# EAGLE board Principal (EAGLE 9.2.2)
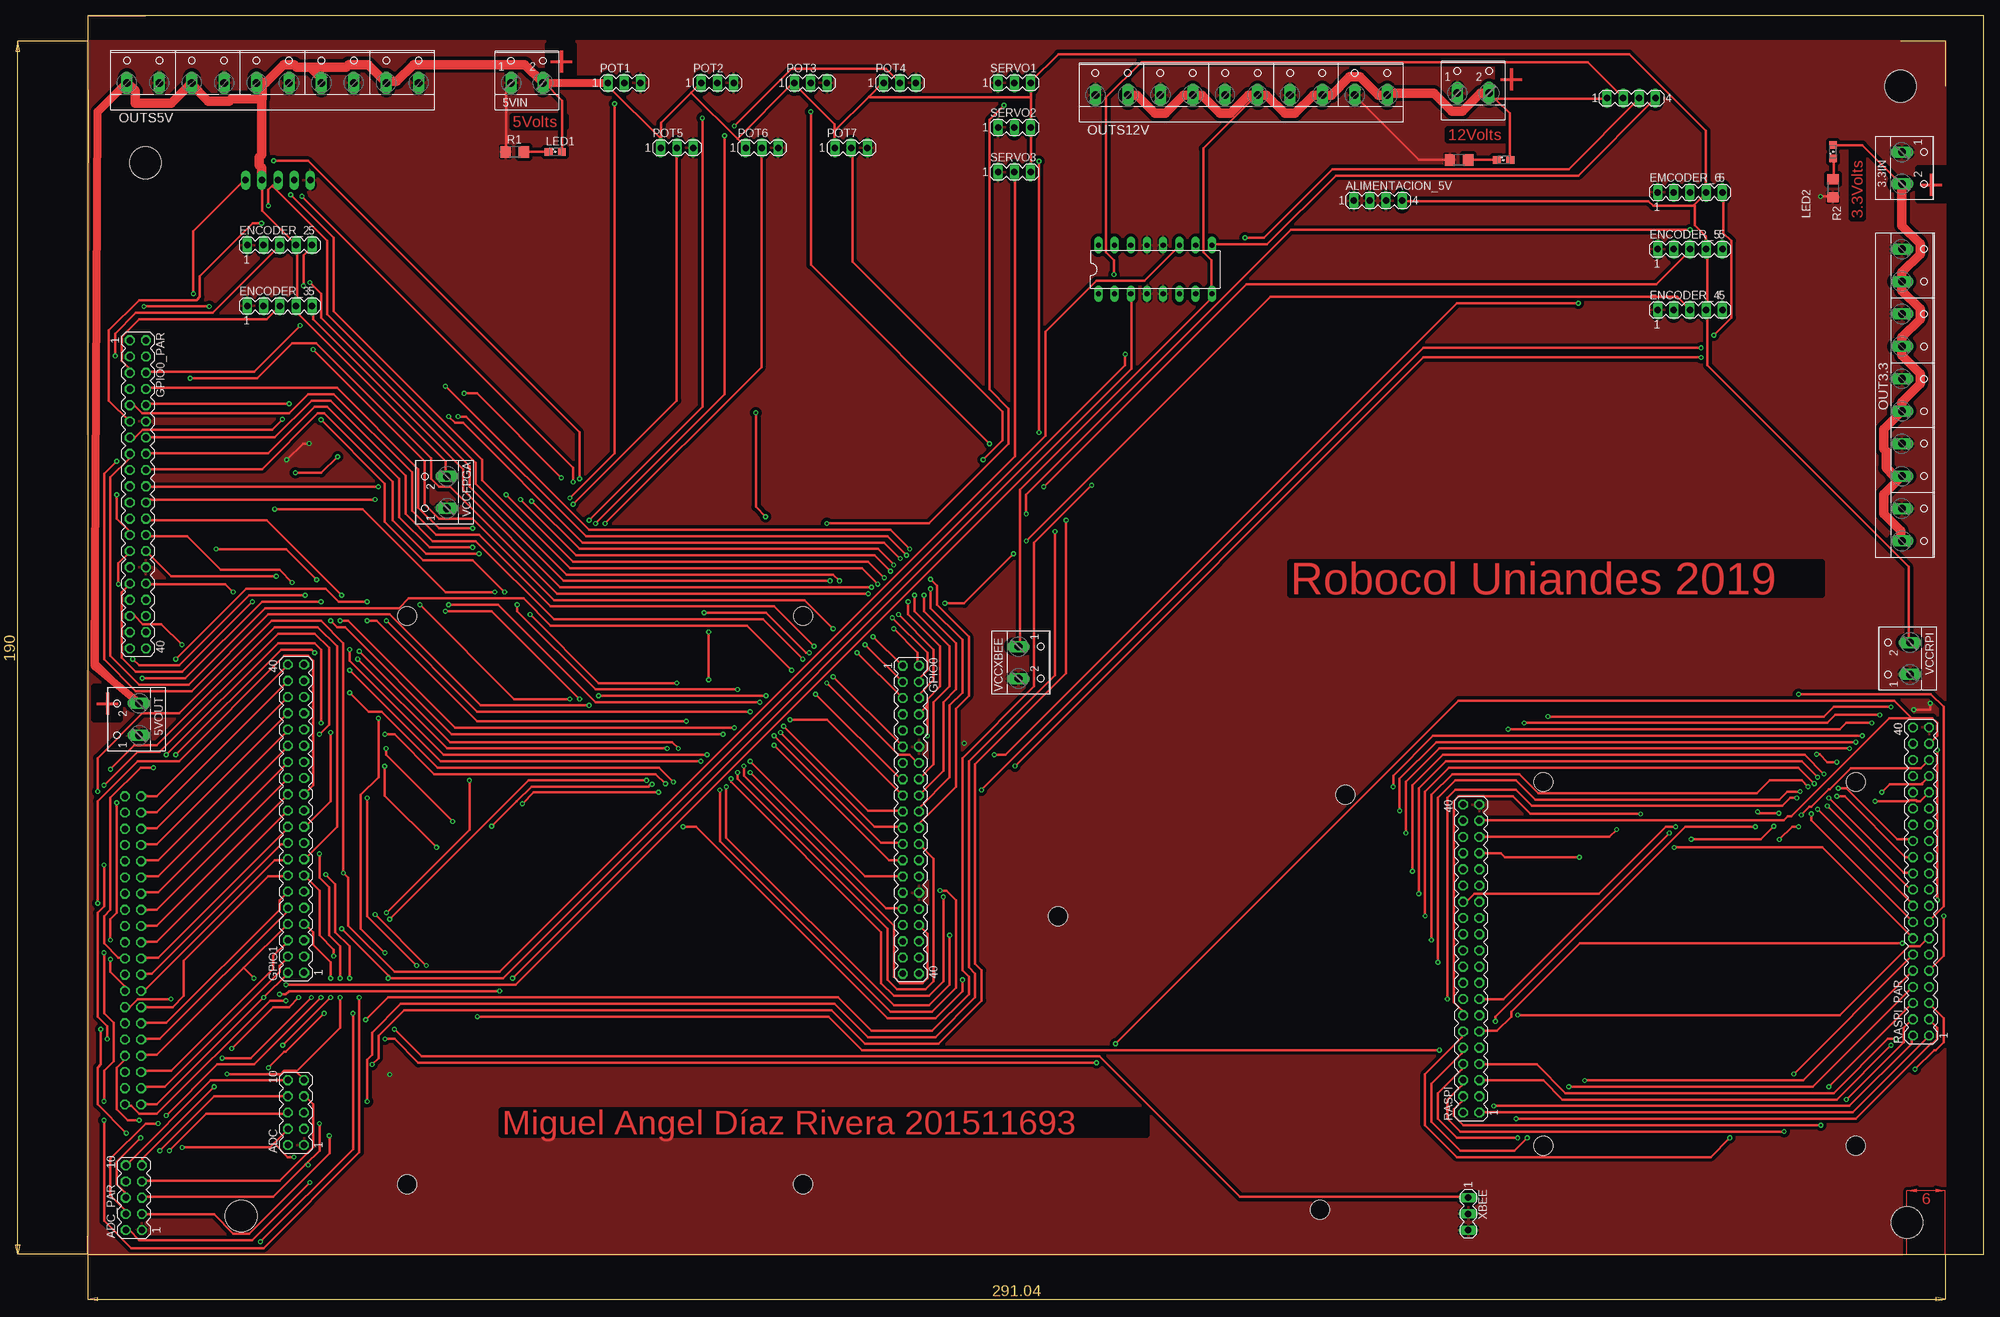
[diagram p2: board, top side]
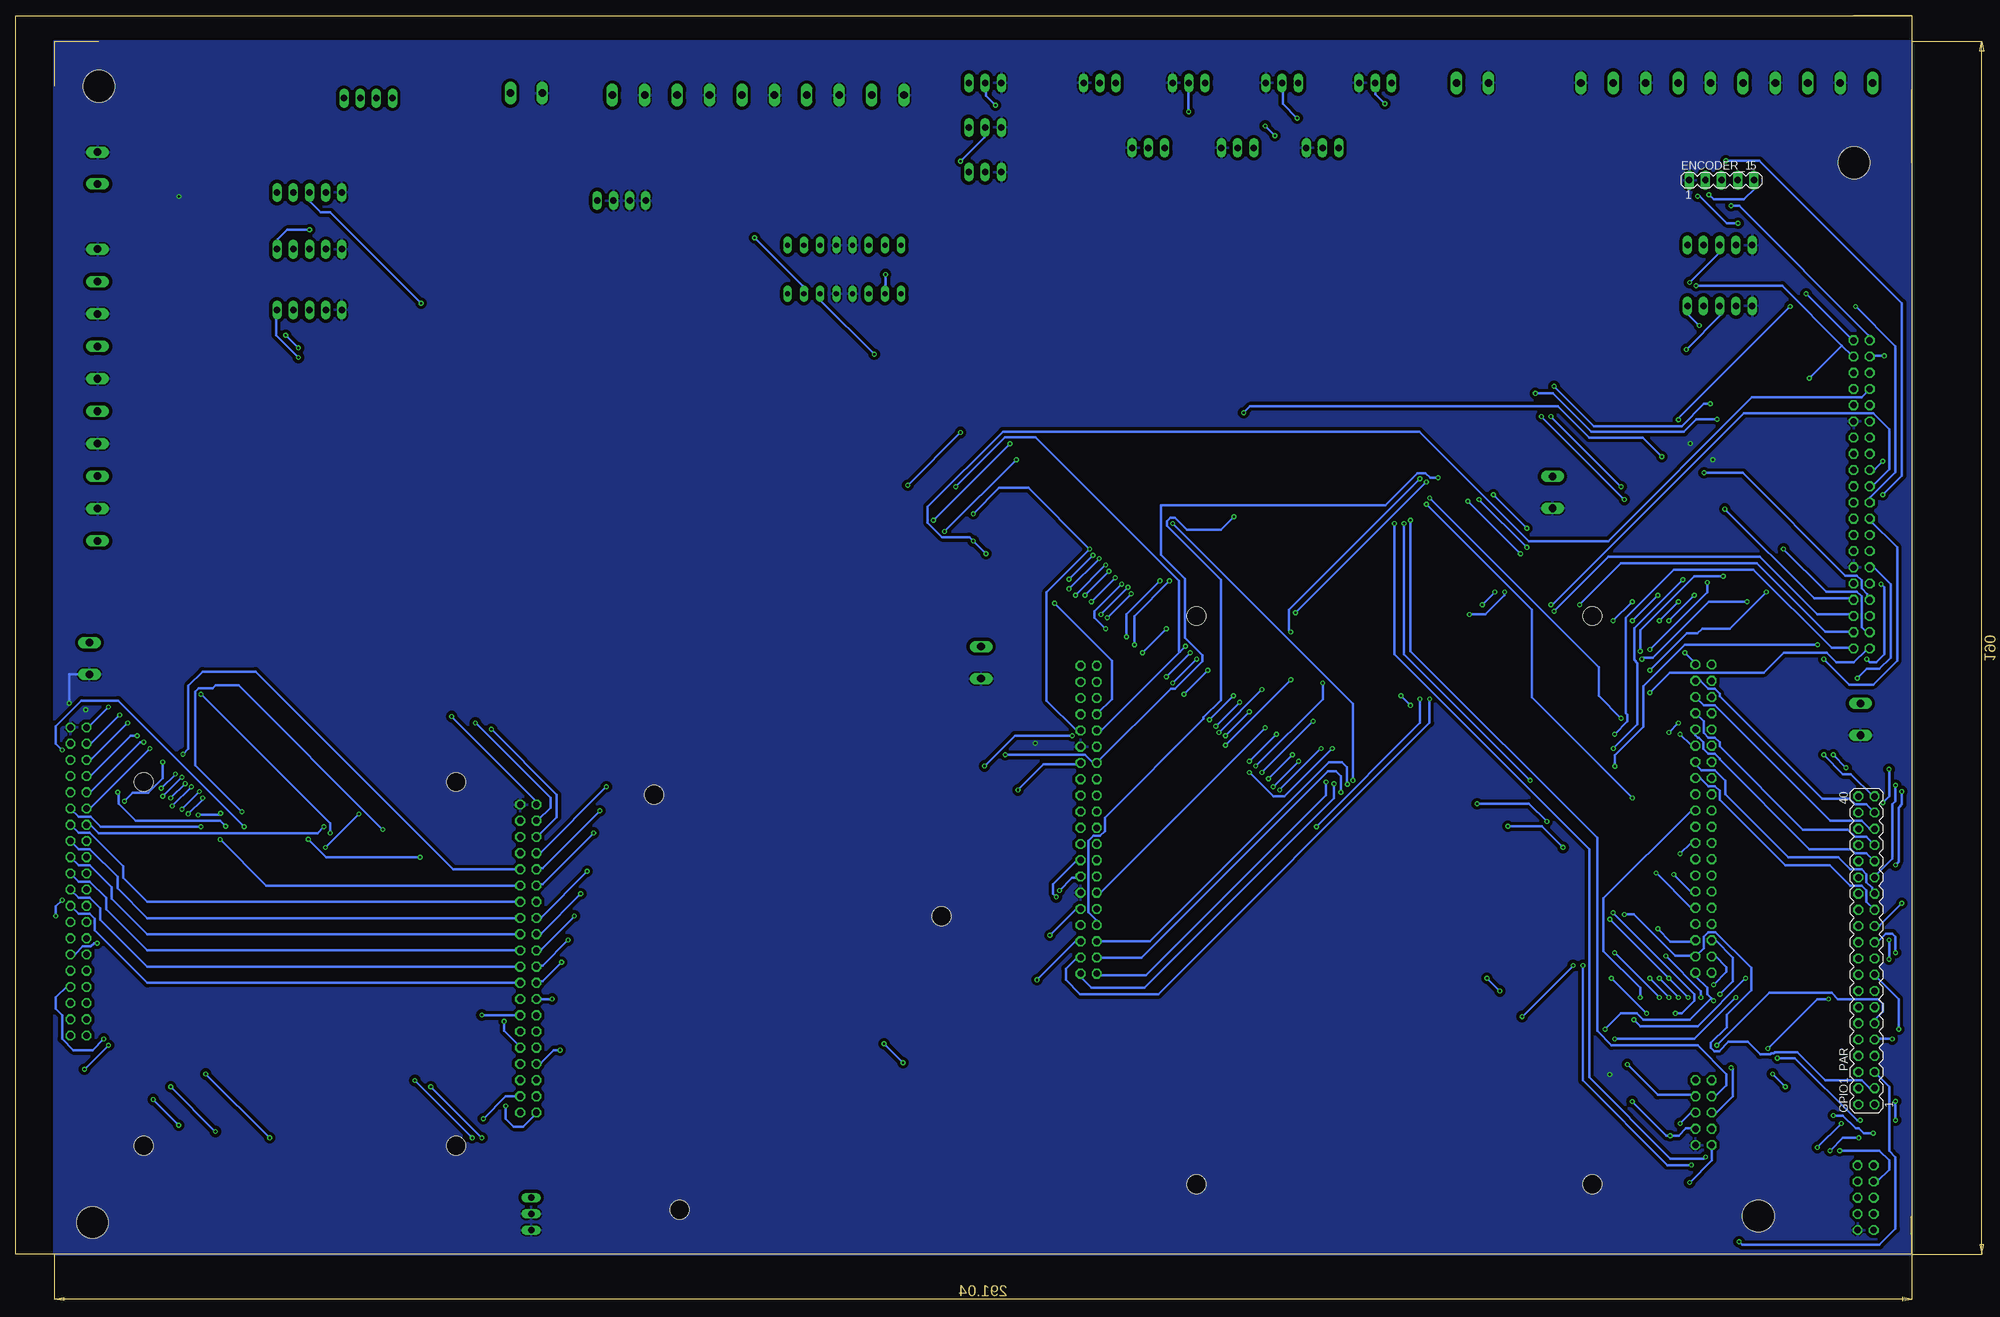
[diagram p3: board, bottom side, seen from below]

Size 297.02 x 194 mm. Coordinates in mm from the lower left corner, seen from the top.
Outline: 0,0 297.02,0 297.02,194 0,194 0,0
Copper layers (1*16): Top 0.035mm / dielectric 1.5mm / Bottom 0.035mm
Design rules "default *": minimum track width 0.4mm, minimum drill 0.35mm, track to track 0.5mm, track to pad 0.5mm, pad to pad 0.5mm, via to via 0.5mm, smd to smd 0.5mm, copper to edge 0mil, drill to drill 6mil, minimum pad ring 10mil, minimum via ring 8mil, stop-mask expansion 4mil, vias tented up to drill 0mil, thermal gap 10mil
Holes 3 mm at 228.02,17 277.02,17 228.02,74 277.02,74 50.02,11 112.02,11 50.02,100 112.02,100 193.02,7 197.02,72 152.02,53
Holes 5 mm at 9.02,171 24.02,6 285.02,5 284.02,183

## Footprints (pad centres in the part's own frame; a part is rotated, then mirrored left to right if it is on the bottom)
W237-102 = drill 1.194 long: 1 -2.5,-1.27; 2 2.5,-1.27
MA05-2 = drill 1.016 octagon: 1 -5.08,-1.27; 2 -5.08,1.27; 3 -2.54,-1.27; 4 -2.54,1.27; 5 0,-1.27; 6 0,1.27; 7 2.54,-1.27; 8 2.54,1.27; 9 5.08,-1.27; 10 5.08,1.27
MA04-1 = drill 1.016 long: 1 -3.81,0; 2 -1.27,0; 3 1.27,0; 4 3.81,0
DIL16 = drill 0.813 long: 1 -8.89,-3.81; 2 -6.35,-3.81; 3 -3.81,-3.81; 4 -1.27,-3.81; 5 1.27,-3.81; 6 3.81,-3.81; 7 6.35,-3.81; 8 8.89,-3.81; 9 8.89,3.81; 10 6.35,3.81; 11 3.81,3.81; 12 1.27,3.81; 13 -1.27,3.81; 14 -3.81,3.81; 15 -6.35,3.81; 16 -8.89,3.81
MA05-1 = drill 1.016 long: 1 -5.08,0; 2 -2.54,0; 3 0,0; 4 2.54,0; 5 5.08,0
MA20-2 = drill 1.016 octagon: 1 -24.13,-1.27; 2 -24.13,1.27; 3 -21.59,-1.27; 4 -21.59,1.27; 5 -19.05,-1.27; 6 -19.05,1.27; 7 -16.51,-1.27; 8 -16.51,1.27; 9 -13.97,-1.27; 10 -13.97,1.27; 11 -11.43,-1.27; 12 -11.43,1.27; 13 -8.89,-1.27; 14 -8.89,1.27; 15 -6.35,-1.27; 16 -6.35,1.27; 17 -3.81,-1.27; 18 -3.81,1.27; 19 -1.27,-1.27; 20 -1.27,1.27; 21 1.27,-1.27; 22 1.27,1.27; 23 3.81,-1.27; 24 3.81,1.27; 25 6.35,-1.27; 26 6.35,1.27; 27 8.89,-1.27; 28 8.89,1.27; 29 11.43,-1.27; 30 11.43,1.27; 31 13.97,-1.27; 32 13.97,1.27; 33 16.51,-1.27; 34 16.51,1.27; 35 19.05,-1.27; 36 19.05,1.27; 37 21.59,-1.27; 38 21.59,1.27; 39 24.13,-1.27; 40 24.13,1.27
SML0805 = smd 1.2 x 1.2: A 1.05,0; C -1.05,0
W237-10P = drill 1.194 long: 1 -22.86,-0.635; 2 -17.78,-0.635; 3 -12.7,-0.635; 4 -7.62,-0.635; 5 -2.54,-0.635; 6 2.54,-0.635; 7 7.62,-0.635; 8 12.7,-0.635; 9 17.78,-0.635; 10 22.86,-0.635
MA03-1 = drill 1.016 long: 1 -2.54,0; 2 0,0; 3 2.54,0
R1206 = smd 1.6 x 1.803: 1 -1.422,0; 2 1.422,0

## Placement (x,y rotation side)
3.3IN  [W237-102]  285.5,170.18 270 top
5VIN  [W237-102]  68.78,184.78 0 top
5VOUT  [W237-102]  6.73,83.82 90 top
12VIN  [W237-102]  217.05,183.19 0 top
ADC  [MA05-2]  32.59,22.21 90 top
ADC_PAR  [MA05-2]  7.19,8.88 90 top
ALIMENTACION_5V  [MA04-1]  202.13,165.09 0 top
CONTROL_RGB  ULN2064BN  [DIL16]  167.21,154.29 0 top
EMCODER_6  [MA05-1]  251.03,166.36 0 top
ENCODER_1  [MA05-1]  29.77,168.26 0 bottom
ENCODER_2  [MA05-1]  30.05,158.1 0 top
ENCODER_3  [MA05-1]  30.05,148.58 0 top
ENCODER_4  [MA05-1]  251.03,147.94 0 top
ENCODER_5  [MA05-1]  251.03,157.47 0 top
GPIO0  [MA20-2]  128.94,68.09 270 top
GPIO0_PAR  [MA20-2]  7.82,119.06 270 top
GPIO1  [MA20-2]  32.59,68.26 90 top
GPIO1_PAR  [MA20-2]  7.06,47.62 90 bottom
LED1  [SML0805]  73.23,172.71 0 top
LED2  [SML0805]  273.43,172.72 90 top
LED3  [SML0805]  221.82,171.44 0 top
LUCESITAS  [MA04-1]  241.81,181.12 0 top
OUT3.3  [W237-10P]  284.86,134.62 270 top
OUTS5V  [W237-10P]  28.96,184.15 0 top
OUTS12V  [W237-10P]  180.72,182.25 0 top
POT1  [MA03-1]  84.02,183.5 0 top
POT2  [MA03-1]  98.63,183.5 0 top
POT3  [MA03-1]  113.23,183.5 0 top
POT4  [MA03-1]  127.2,183.5 0 top
POT5  [MA03-1]  92.28,173.34 0 top
POT6  [MA03-1]  105.61,173.34 0 top
POT7  [MA03-1]  119.58,173.34 0 top
R1  [R1206]  66.88,172.71 0 top
R2  [R1206]  273.43,167 90 top
R3  [R1206]  214.83,171.44 0 top
RASPI  [MA20-2]  216.74,46.34 90 top
RASPI_PAR  [MA20-2]  287.22,58.41 90 top
SERVO1  [MA03-1]  145.16,183.51 0 top
SERVO2  [MA03-1]  145.16,176.53 0 top
SERVO3  [MA03-1]  145.16,169.54 0 top
VCCFPGA  [W237-102]  54.99,119.38 90 top
VCCRPI  [W237-102]  284.23,93.34 90 top
VCCXBEE  [W237-102]  147.07,92.71 270 top
XBEE  [MA03-1]  216.28,6.35 270 top

## Tracks (layer width: path | path; a pad name or v marks a point on that pad's centre or on a via)
3.3VOLTIOS
  Top 0.4: LED2.A 273.52,173.75 278.02,173.75 284.02,167.75 3.3IN.2 | 281.89,119.62 284.02,121.75 OUT3.3.8 | 281.89,119.62 281.77,119.5 281.77,116.25 284.02,114 284.02,112.01 284.02,112 OUT3.3.10 | 281.77,119.75 281.89,119.62
  Top 1.524: 3.3IN.2 284.23,161.14 287.08,158.29 287.08,156.67 284.23,153.82 OUT3.3.2 284.23,150.98 287.08,148.13 287.08,146.51 284.23,143.66 OUT3.3.4 284.23,140.82 287.08,137.97 287.08,136.35 284.23,133.5 OUT3.3.6 281.37,129.23 281.37,126.19 281.77,125.8 281.77,123.19 283.04,121.92 OUT3.3.8 281.37,119.07 281.37,116.03 284.02,113.39 284.02,112.01
12VOLTIOS
  Top 0.4: 220.64,180.88 219.77,181.75 12VIN.2 | 220.64,180.88 222.77,178.75 222.77,171.5 LED3.A | LUCESITAS.1 237.77,181 220.77,181 220.64,180.88 | VCCXBEE.1 146.02,95.25 146.02,119.75 176.02,149.75 176.02,150.25 CONTROL_RGB.8 176.02,150.5 176.02,155.75 174.77,157 174.77,173.25 183.02,181.5 OUTS12V.6
  Top 1.524: 12VIN.2 218.21,181.92 215.36,179.07 213.73,179.07 210.88,181.92 203.89,181.92 OUTS12V.10 202.16,181.61 199.31,184.46 197.69,184.46 194.84,181.61 OUTS12V.8 192,181.61 189.15,178.76 187.53,178.76 184.68,181.61 OUTS12V.6 181.84,181.61 178.99,178.76 177.37,178.76 174.52,181.61 OUTS12V.4 171.68,181.61 168.83,178.76 167.21,178.76 164.36,181.61 OUTS12V.2
+5V3
  Top 0.4: 251.64,164.38 253.52,166.25 EMCODER_6.4 253.52,166.5 253.52,176 241.48,188.03 152.05,188.03 147.77,183.75 SERVO1.3 147.77,183.5 147.77,181.25 | 251.64,164.38 251.52,164.25 245.27,164.25 244.52,165 206.02,165 ALIMENTACION_5V.4 | VCCRPI.2 285.27,96 285.27,107.75 253.77,139.25 253.77,147.75 ENCODER_4.4 253.77,148 253.77,157.25 ENCODER_5.4 253.52,157.5 253.52,159.5 251.77,161.25 251.77,164.25 251.64,164.38 | 1.52,179 1.52,92.75 7.77,86.5 5VOUT.2 | 16.02,183.5 OUTS5V.3 16.27,183.5 | LED1.A 74.27,172.75 74.27,180.75 71.52,183.5 5VIN.2 71.77,183.5 81.27,183.5 POT1.1 81.52,183.5 81.52,183.29 81.52,183 89.77,174.75 | SERVO3.3 147.77,169.75 147.77,176.5 SERVO2.3 147.77,176.75 147.77,181.25 | 89.77,174.75 89.77,177.25 94.52,182 | 89.77,174.75 89.77,173.5 POT5.1 89.77,174.75 | 94.52,182 96.02,183.5 POT2.1 | 94.52,182 101.77,174.75 | 101.77,174.75 103.02,173.5 POT6.1 | 101.77,174.75 110.52,183.5 | 117.02,176 117.02,177 110.52,183.5 | 117.02,176 117.02,173.5 POT7.1 | 110.52,183.5 POT3.1 | 117.02,176 122.39,181.38 | 122.39,181.38 124.52,183.5 POT4.1 | 147.77,181.25 122.52,181.25 122.39,181.38 | 27.27,183.75 28.77,183.75 31.02,186 34.27,186 34.39,185.88 | 27.27,183.75 26.52,183.75 OUTS5V.5 27.27,183.75 | 34.39,185.88 36.52,183.75 OUTS5V.7 | 35.05,186 34.8,186 34.52,186 34.39,185.88 | VCCFPGA.2 56.02,122 56.02,124.25 32.77,147.5 32.77,148.5 ENCODER_3.4 32.77,148.75 32.77,158 ENCODER_2.4 32.52,158.25 27.27,163.5 27.27,168.25 ENCODER_1.4 27.27,168.5 27.27,181 | 27.27,181 27.27,183.75 | 46.77,183.75 OUTS5V.9 | 27.27,181 20.77,181
  Top 1.27: 5VIN.2 81.3,183.5 81.52,183.29 | 5VOUT.2 1.09,92.13 1.52,179 OUTS5V.1
  Top 1.524: 46.77,183.75 48.39,183.75 51,186.37 68.42,186.37 5VIN.2 | OUTS5V.9 43.88,186.37 40.84,186.37 40.48,186 35.05,186 32.67,186 32.31,186.37 30.69,186.37 27.83,183.51 OUTS5V.5 | OUTS5V.7 36.58,184.22 34.8,186 | OUTS5V.5 27.27,182.66 27.27,181 22.48,181 22.15,180.66 18.85,180.66 16.02,183.5 | OUTS5V.3 13.08,180.34 7.37,180.34 7.37,182.25 OUTS5V.1 | OUTS5V.5 27.23,182.7 27.23,172.28 26.8,171.86 26.8,170.64 27.23,170.22 ENCODER_1.4
GND  (via drill 0.35)
  Top 0.4: v271.49,165.72 273.29,165.72 R2.1 | R1.1 65.52,172.75 65.52,182.75 66.27,183.5 5VIN.1 | R3.1 213.27,171.5 208.52,171.5 198.52,181.5 OUTS12V.9 | v286.08,85.32 288.67,85.32 v288.67,86.33 | v31.14,124.46 33.71,127.03 v34.65,127.03
  Bottom 0.4: v288.67,86.33 288.67,90.84 VCCRPI.1
  other vias: 47.29,28.17 137.31,80.06
  pour Bottom: -0.03,0 -0.03,190 291.02,190 291.02,0
  pour Top: -0.03,190 291.02,190 291.02,0 -0.03,0
N$1
  Top 0.4: LED2.C 273.52,171.5 273.52,168.5 R2.2
N$4  (via drill 0.35)
  Top 0.4: v33.77,151.75 33.77,156.5 35.27,158 ENCODER_2.5 | v126.02,99.75 131.52,94.25 131.52,91.5 130.27,90.25 130.27,89.75 GPIO0.4 | v122.27,103.5 73.52,103.5 56.77,120.25 55.02,120.25 53.77,121.5 53.77,124.75 35.77,142.75 32.02,142.75 26.52,137.25 v16.02,137.25
  Bottom 0.4: 10.89,142.38 20.27,151.75 v33.77,151.75 | 10.89,142.38 9.27,140.75 GPIO0_PAR.4 | v122.27,103.5 v126.02,99.75 | 10.89,142.38 v16.02,137.25
N$8  (via drill 0.35)
  Top 0.4: v60.27,113.75 55.02,113.75 51.77,117 51.77,123 39.02,135.75 9.27,135.75 GPIO0_PAR.8 | v65.52,119 76.02,108.5 122.27,108.5 v124.77,106 | v128.52,102.25 128.52,100.25 133.52,95.25 133.52,89 131.52,87 131.52,86 131.39,85.88 | 131.39,85.88 130.27,84.75 GPIO0.8 | v252.77,140.5 209.27,140.5 v145.27,76.5 | v131.52,81.25 131.52,85.75 131.39,85.88
  Bottom 0.4: v65.52,119 v60.27,113.75 | v128.52,102.25 v124.77,106 | v252.77,140.5 256.27,144 256.27,147.75 ENCODER_4.5 | v145.27,76.5 140.52,81.25 v131.52,81.25
N$9  (via drill 0.35)
  Top 0.4: v113.77,95.25 107.52,101.5 72.52,101.5 61.27,112.75 54.52,112.75 50.77,116.5 50.77,122.5 38.52,134.75 34.52,134.75 31.52,131.75 8.52,131.75 7.27,133 6.77,133 GPIO0_PAR.9 | v149.77,120.25 181.52,152 245.77,152 251.02,157.25 ENCODER_5.3
  Bottom 0.4: 114.64,94.38 127.02,82 127.52,82 GPIO0.9 | 114.64,94.38 v113.77,95.25 | v149.77,120.25 142.02,128 137.27,128 114.77,105.5 114.77,94.5 114.64,94.38
N$11  (via drill 0.35)
  Top 0.4: v116.77,90.5 127.52,79.75 GPIO0.11 | v113.02,94.25 112.52,94.25 106.27,100.5 v96.52,100.5 | v76.02,121 76.02,123.25 v33.52,165.75 | v27.2,161.54 25.8,161.54 17.52,153.25 17.52,150 17.02,149.5 8.02,149.5 3.27,144.75 3.27,133.75 6.52,130.5 GPIO0_PAR.11
  Bottom 0.4: v113.02,94.25 v116.77,90.5 | v76.02,121 v96.52,100.5 | v33.52,165.75 33.13,165.75 28.92,161.54 v27.2,161.54
N$14  (via drill 0.35)
  Top 0.4: v112.02,93.25 105.77,99.5 73.02,99.5 60.77,111.75 54.02,111.75 49.77,116 49.77,122 38.02,133.75 35.02,133.75 29.27,128 9.27,128 GPIO0_PAR.14 | v115.77,89.5 127.02,78.25 128.77,78.25 130.02,77 GPIO0.14 | v254.77,144 257.52,146.75 257.52,158.75 256.27,160 256.27,166.25 EMCODER_6.5 | v252.77,142 209.27,142 v140.02,72.75
  Bottom 0.4: v115.77,89.5 v112.02,93.25 | v252.77,142 v254.77,144 | v140.02,72.75 136.02,76.75 130.27,76.75 GPIO0.14
N$15  (via drill 0.35)
  Top 0.4: v110.27,91.5 103.27,98.5 72.52,98.5 68.27,102.75 50.27,102.75 48.77,101.25 27.77,101.25 15.77,89.25 8.02,89.25 3.52,93.75 3.52,121.75 6.52,124.75 6.52,125.25 GPIO0_PAR.15 | v114.02,87.75 127.52,74.25 GPIO0.15
  Bottom 0.4: v114.02,87.75 v110.27,91.5
N$16  (via drill 0.35)
  Top 0.4: v60.27,110.75 53.52,110.75 48.77,115.5 48.77,121.5 37.52,132.75 35.52,132.75 28.27,125.5 9.27,125.5 GPIO0_PAR.16 | v67.77,118.25 76.52,109.5 123.27,109.5 v125.77,107 | v129.52,103.25 129.52,100.75 135.02,95.25 135.02,89 132.52,86.5 132.52,76.75 GPIO0.16
  Bottom 0.4: v67.77,118.25 v60.27,110.75 | v129.52,103.25 v125.77,107
N$17  (via drill 0.35)
  Top 0.4: v4.52,124.25 2.52,122.25 2.52,93.25 7.52,88.25 16.27,88.25 28.27,100.25 47.27,100.25 61.52,86 v78.52,86 | v106.27,87.5 v80.02,87.5 | v110.02,83.75 115.77,83.75 127.52,72 GPIO0.17
  Bottom 0.4: v4.52,124.25 5.77,123 6.52,123 GPIO0_PAR.17 | v80.02,87.5 v78.52,86 | v110.02,83.75 v106.27,87.5
N$18  (via drill 0.35)
  Top 0.4: v61.27,109.75 53.02,109.75 47.77,115 47.77,121 37.02,131.75 36.02,131.75 27.27,123 9.27,123 GPIO0_PAR.18 | v69.52,118 77.02,110.5 123.77,110.5 v126.27,108 | v131.02,103.25 131.02,100.75 136.02,95.75 136.02,88.5 134.02,86.5 134.02,75.75 130.27,72 GPIO0.18
  Bottom 0.4: v69.52,118 v61.27,109.75 | v131.02,103.25 v126.27,108
N$19  (via drill 0.35)
  Top 0.4: v109.02,82.75 122.27,69.5 127.52,69.5 GPIO0.19 | v105.27,86.5 79.52,86.5 64.27,101.75 v56.52,101.75
  Bottom 0.4: v105.27,86.5 v109.02,82.75 | v56.52,101.75 56.26,101.75 26.26,131.75 6.02,131.75 3.52,129.25 3.52,123 6.02,120.5 6.52,120.5 GPIO0_PAR.19
N$20  (via drill 0.35)
  Top 0.4: v132.02,104.25 132.02,101.25 137.02,96.25 137.02,88 135.02,86 135.02,74.75 130.27,70 130.27,69.5 GPIO0.20 | v127.27,109 124.77,111.5 77.52,111.5 58.77,130.25 57.52,130.25 v56.52,131.25 | v45.52,120.25 9.27,120.25 GPIO0_PAR.20
  Bottom 0.4: v127.27,109 v132.02,104.25 | v45.52,120.25 v56.52,131.25
N$21  (via drill 0.35)
  Top 0.4: v108.52,81.75 123.27,67 127.52,67 GPIO0.21 | v101.77,88.5 79.52,88.5 67.27,100.75 v67.27,101.75 | v65.27,103.75 60.27,108.75 52.52,108.75 46.52,114.75 46.52,120.75 v36.52,130.75 | v19.02,148.5 v8.77,148.5
  Bottom 0.4: v101.77,88.5 v108.52,81.75 | v65.27,103.75 v67.27,101.75 | v36.52,130.75 36.52,131 v19.02,148.5 | v8.77,148.5 2.52,142.25 2.52,122.5 6.52,118.5 6.52,118 GPIO0_PAR.21
N$22  (via drill 0.35)
  Top 0.4: v132.02,105.75 133.02,104.75 133.02,101.75 138.02,96.75 138.02,87.5 136.02,85.5 136.02,73.25 130.27,67.5 130.27,67 GPIO0.22 | v128.27,109.5 125.27,112.5 78.02,112.5 59.27,131.25 v58.02,131.25 | v45.02,118.25 9.52,118.25 9.27,118 GPIO0_PAR.22
  Bottom 0.4: v128.27,109.5 v132.02,105.75 | v45.02,118.25 v58.02,131.25
N$23  (via drill 0.35)
  Top 0.4: v13.77,93.25 24.77,104.25 37.27,104.25 39.27,102.25 v43.77,102.25 | v46.77,99.25 61.02,85 v103.77,85 | v107.52,81.25 124.27,64.5 127.52,64.5 GPIO0.23
  Bottom 0.4: v13.77,93.25 9.77,89.25 6.02,89.25 2.27,93 2.27,110.75 6.52,115 GPIO0_PAR.23 | v46.77,99.25 v43.77,102.25 | v107.52,81.25 v103.77,85
N$24  (via drill 0.35)
  Top 0.4: v39.77,103.25 28.02,115 9.27,115 GPIO0_PAR.24 | v43.77,99.25 45.27,99.25 61.02,83.5 v93.77,83.5 | v101.77,75.5 101.77,74.5 125.27,51 125.27,43 126.77,41.5 131.27,41.5 132.52,42.75 132.52,62 130.27,64.25 GPIO0.24
  Bottom 0.4: v43.77,99.25 v39.77,103.25 | v101.77,75.5 v93.77,83.5
N$25  (via drill 0.35)
  Top 0.4: v4.52,119 4.52,115.25 6.52,113.25 6.52,112.75 GPIO0_PAR.25 | v29.08,171.3 34.46,171.3 77.02,128.75 v77.02,121.5 | v97.27,90 v97.27,97.5 | v107.52,79.75 125.52,61.75 127.52,61.75 GPIO0.25
  Bottom 0.4: v4.52,119 1.52,122 1.52,149 23.82,171.3 v29.08,171.3 | v77.02,121.5 97.52,101 97.52,97.75 v97.27,97.5 | v107.52,79.75 v97.27,90
N$26  (via drill 0.35)
  Top 0.4: v32.02,105.25 30.02,107.25 20.77,107.25 15.52,112.5 9.27,112.5 GPIO0_PAR.26 | v41.02,94.75 41.02,93 55.77,78.25 v97.02,78.25 | v100.77,74.5 100.77,74 124.27,50.5 124.27,42.5 126.27,40.5 131.77,40.5 134.02,42.75 v134.02,56
  Bottom 0.4: v32.02,105.25 32.02,103.75 v41.02,94.75 | v100.77,74.5 v97.02,78.25 | v134.02,56 134.52,56.5 134.52,58 130.77,61.75 130.27,61.75 GPIO0.26
N$27  (via drill 0.35)
  Top 0.4: v103.77,77.25 121.77,59.25 127.52,59.25 GPIO0.27 | v99.52,81.5 57.02,81.5 40.27,98.25 39.02,98.25 v38.02,99.25 | v34.02,103.25 25.27,103.25 14.27,92.25 8.02,92.25 v7.02,93.25 | v4.77,105 4.77,108.25 6.52,110 GPIO0_PAR.27
  Bottom 0.4: v99.52,81.5 v103.77,77.25 | v34.02,103.25 v38.02,99.25 | v7.02,93.25 6.52,92.75 5.52,92.75 4.27,94 4.27,104.5 v4.77,105
N$28  (via drill 0.35)
  Top 0.4: v133.52,57 134.52,57 136.02,55.5 136.02,41.75 132.27,38 125.77,38 99.02,64.75 v99.02,72.75 | v92.52,79.25 91.52,80.25 56.77,80.25 v42.52,94.5 | v29.52,106.25 13.02,106.25 9.27,110 GPIO0_PAR.28
  Bottom 0.4: v133.52,57 131.52,59 130.27,59 GPIO0.28 | v92.52,79.25 v99.02,72.75 | v42.52,94.5 42.52,97.75 34.02,106.25 v29.52,106.25
N$29  (via drill 0.35)
  Top 0.4: v101.27,82.5 57.52,82.5 40.77,99.25 v39.52,99.25 | v36.52,102.25 27.27,102.25 15.27,90.25 v8.52,90.25
  Bottom 0.4: v101.27,82.5 127.02,56.75 127.52,56.75 GPIO0.29 | v36.52,102.25 v39.52,99.25 | v8.52,90.25 7.02,91.75 5.02,91.75 3.27,93.5 3.27,105 6.02,107.75 6.52,107.75 GPIO0_PAR.29
N$31  (via drill 0.35)
  Top 0.4: v103.77,75.5 125.02,54.25 127.52,54.25 GPIO0.31 | v90.77,79.25 56.27,79.25 v42.27,93.25 | v25.77,102.25 14.77,91.25 7.52,91.25 5.27,93.5 5.27,103.75 6.52,105 GPIO0_PAR.31
  Bottom 0.4: v103.77,75.5 100.02,71.75 98.27,71.75 v90.77,79.25 | v42.27,93.25 42.02,93.5 40.52,93.5 31.77,102.25 v25.77,102.25
N$32  (via drill 0.35)
  Top 0.4: v22.77,103.75 21.52,105 9.27,105 GPIO0_PAR.32 | v41.02,91.5 55.27,77.25 v96.02,77.25 | v100.02,73.25 100.02,65.25 126.27,39 131.77,39 135.02,42.25 v135.02,50
  Bottom 0.4: v22.77,103.75 28.47,98.04 32.77,98.04 33.53,97.28 35.23,97.28 v41.02,91.5 | v100.02,73.25 v96.02,77.25 | v135.02,50 130.77,54.25 130.27,54.25 GPIO0.32
N$33  (via drill 0.35)
  Top 0.4: v32.51,122.43 36.58,122.43 v39.12,124.97 | v104.65,131.83 104.65,117.09 v106.17,115.57
  Bottom 0.4: v32.51,122.43 26.43,122.43 10.35,106.35 8.56,106.35 7.82,105.61 7.82,104.34 6.92,103.44 6.92,102.92 GPIO0_PAR.33 | v39.12,124.97 42.1,127.95 50.51,127.95 55.4,132.84 103.63,132.84 v104.65,131.83 | v106.17,115.57 108.2,113.54 113.53,113.54 115.39,115.4 116.14,115.4 116.67,114.87 116.67,114.13 108.2,105.67 108.2,86.83 110.92,84.12 110.92,83.9 126.41,68.41 126.41,66.3 127.16,65.55 128.19,65.55 128.93,64.81 128.93,53.6 127.67,52.34 GPIO0.33
N$34  (via drill 0.35)
  Top 0.4: v29.27,116.75 43.02,116.75 56.02,103.75 v63.77,103.75 | v69.27,100.25 80.02,89.5 v92.27,89.5 | v102.77,76.5 102.77,75 126.27,51.5 126.27,43.5 127.27,42.5 130.77,42.5 131.52,43.25 131.52,50.25 130.27,51.5 GPIO0.34
  Bottom 0.4: v29.27,116.75 15.27,102.75 9.27,102.75 GPIO0_PAR.34 | v63.77,103.75 63.77,103.25 66.77,100.25 v69.27,100.25 | v92.27,89.5 92.27,87 v102.77,76.5
N$35  (via drill 0.35)
  Top 0.4: v88.41,73.65 88.19,73.65 87.83,73.29 69.48,73.29 67.17,70.98 v63.25,67.06 | v54.61,63.75 46.48,71.88 v46.48,76.45 | GPIO0_PAR.35 7.3,100 8.56,98.74 11.49,98.74 v14.73,95.5
  Bottom 0.4: GPIO0.35 119.36,49.05 91.31,77.1 89.29,77.1 88.51,76.32 88.51,73.75 v88.41,73.65 | v63.25,67.06 57.91,67.06 v54.61,63.75 | v14.73,95.5 35.56,95.5 42.03,89.04 42.03,82.69 46.48,78.23 v46.48,76.45
N$36  (via drill 0.35)
  Top 0.4: v56.02,100.75 63.27,100.75 v77.02,87 | v93.27,67 95.27,67 125.27,37 132.77,37 137.02,41.25 v137.02,43
  Bottom 0.4: v56.02,100.75 47.52,109.25 23.77,109.25 14.77,100.25 9.27,100.25 GPIO0_PAR.36 | v77.02,87 77.02,83.25 v93.27,67 | v137.02,43 130.77,49.25 130.27,49.25 GPIO0.36
N$37  (via drill 0.35)  (1 unrouted)
  Top 0.4: v89.41,72.39 69.85,72.39 v68.07,70.61 | v57.15,67.82 46.74,78.23 v46.74,79.25 | v35.83,105.68 31.02,110.49 v20.07,110.49
  Bottom 0.4: GPIO0.37 120.63,46.51 91.44,75.69 90.17,75.69 89.41,74.93 v89.41,72.39 | v68.07,70.61 59.94,70.61 v57.15,67.82 | v46.74,79.25 42.93,83.06 42.93,92.64 43.42,93.13 43.42,98.12 35.84,105.69 | GPIO0_PAR.37 7.04,97.47 7.82,98.25 7.82,103.07 8.56,103.81 13.38,103.81 v20.07,110.49
N$38  (via drill 0.35)
  Top 0.4: v52.02,101.75 66.77,87 v75.52,87
  Bottom 0.4: v52.02,101.75 45.52,108.25 24.27,108.25 13.52,97.5 9.27,97.5 GPIO0_PAR.38 | v75.52,87 75.52,83.25 118.02,40.75 130.27,40.75 132.52,43 132.52,44.75 130.77,46.5 130.27,46.5 GPIO0.38
N$39  (via drill 0.35)
  Top 0.4: v41.02,87.97 43.99,85 46.02,85 54.77,76.25 89.48,76.25 v91.74,73.99
  Bottom 0.4: v41.02,87.97 37.87,91.12 23.15,91.12 20.02,94.25 13.27,94.25 11.77,92.75 9.02,92.75 7.02,94.75 6.77,94.75 GPIO0_PAR.39 | v91.74,73.99 91.74,71.96 119.94,43.75 127.52,43.75 GPIO0.39
N$40  (via drill 0.35)
  Top 0.4: v46.52,81.5 48.02,81.5 54.27,75.25 88.98,75.25 v90.48,73.74
  Bottom 0.4: v46.52,81.5 44.52,83.5 44.52,84.5 44.77,84.75 44.77,99.75 37.27,107.25 24.77,107.25 12.52,95 9.27,95 GPIO0_PAR.40 | v90.48,73.74 90.48,71.46 120.19,41.75 128.52,41.75 130.02,43.25 130.02,43.75 GPIO0.40
N$41  (via drill 0.35)
  Top 0.4: v31.02,39.75 28.52,39.75 10.77,22 8.02,22 6.77,23.25 6.02,23.25 GPIO1_PAR.1 | v48.02,35.25 52.27,31 158.52,31 180.52,9 216.27,9 XBEE.1
  Bottom 0.4: 31.39,40.12 32.02,40.75 32.02,41.75 33.77,43.5 33.77,44 GPIO1.1 | 31.39,40.12 v31.02,39.75 | v48.02,35.25 45.52,37.75 43.02,37.75 42.02,36.75 34.77,36.75 31.39,40.12
N$42  (via drill 0.35)
  Top 0.4: GPIO1_PAR.2 8.52,23.5 10.77,23.5 v27.52,40.25 31.27,44 GPIO1.2 | 285.77,84 289.02,84 289.77,83.25 289.77,81.25 288.52,80 RASPI_PAR.37 | 285.77,84 282.24,84 266.89,68.65 266.38,68.65 265.73,68 218.02,68 RASPI.37 | v46.52,33.75 48.02,33.75 51.77,30 v158.02,30 | v161.02,33 214.77,86.75 283.02,86.75 285.77,84
  Bottom 0.4: v27.52,40.25 34.02,33.75 v46.52,33.75 | v161.02,33 v158.02,30
N$44  (via drill 0.35)
  Top 0.4: v31.02,42.25 67.02,42.25 163.52,138.75 163.52,150.25 CONTROL_RGB.3 | GPIO1_PAR.4 8.52,26.25 12.02,26.25 30.02,44.25 30.02,45.25 31.27,46.5 GPIO1.4
  Bottom 0.4: v31.02,42.25 29.02,44.25 29.02,45 30.77,46.75 31.27,46.75 GPIO1.4
N$45  (via drill 0.35)
  Top 0.4: v39.77,51 47.14,43.62 | 47.14,43.62 47.52,43.25 65.02,43.25 150.02,128.25 150.02,144.5 158.02,152.5 165.52,152.5 171.02,158 CONTROL_RGB.11 | v27.02,2 41.52,16.5 v41.52,37.75 | v47.02,43.25 47.02,43.5 47.14,43.62
  Bottom 0.4: v39.77,51 37.77,49 34.02,49 GPIO1.5 | v27.02,2 26.52,1.5 5.02,1.5 2.52,4 2.52,15.25 3.52,16.25 3.52,26.25 5.77,28.5 GPIO1_PAR.5 | v47.02,43.25 v41.52,37.75
N$46  (via drill 0.35)
  Top 0.4: v162.52,141 162.52,139.25 v66.52,43.25 | v64.52,41.25 31.52,41.25 31.02,40.75 v30.02,40.75 | GPIO1_PAR.6 8.52,28.75 13.02,28.75 29.02,44.75 29.02,46.75 31.27,49 GPIO1.6
  Bottom 0.4: CONTROL_RGB.6 171.02,149.5 v162.52,141 | v64.52,41.25 v66.52,43.25 | v30.02,40.75 28.02,42.75 28.02,46.5 30.77,49.25 31.27,49.25 GPIO1.6
N$47  (via drill 0.35)
  Top 0.4: v8.02,21 6.27,21 4.52,22.75 4.52,29.25 5.77,30.5 5.77,31 GPIO1_PAR.7 | v21.02,30.75 25.52,30.75 v35.02,40.25 | v38.02,43.25 38.02,45.75 35.27,48.5 35.27,50.5 34.02,51.75 GPIO1.7 | v143.52,180 141.27,177.75 141.27,135.5 144.27,132.5 144.27,127 131.77,114.5 v115.77,114.5 | v87.52,74.25 69.02,74.25 v47.27,52.5
  Bottom 0.4: v8.02,21 8.52,21 18.27,30.75 v21.02,30.75 | v35.02,40.25 v38.02,43.25 v47.27,52.5 | v143.52,180 145.02,181.5 145.02,183.5 SERVO1.2 | v115.77,114.5 87.52,86.25 v87.52,74.25
N$48  (via drill 0.35)
  Top 0.4: 24.39,44.88 31.27,51.75 GPIO1.8 | 24.39,44.88 10.77,31.25 8.52,31.25 GPIO1_PAR.8 | v149.02,128.75 v149.02,171.25 | v157.27,120.5 148.27,111.5 148.27,89 137.02,77.75 137.02,44.5 138.02,43.5 138.02,40.75 132.27,35 122.77,35 117.52,40.25 47.02,40.25 v43.52,36.75 | 24.39,44.88 v26.02,43.25
  Bottom 0.4: v149.02,171.25 145.27,175 145.27,176.5 SERVO2.2 | v157.27,120.5 v149.02,128.75 | v43.52,36.75 42.52,35.75 33.52,35.75 v26.02,43.25
N$49  (via drill 0.35)
  Top 0.4: v3.02,33.75 3.02,35.75 1.52,37.25 1.52,53.5 2.52,54.5 v2.52,61 | v1.52,72.5 1.52,77.75 8.52,84.75 14.27,84.75 28.77,99.25 36.52,99.25 40.02,95.75 v40.02,59.75 40.77,59 40.77,51.5 48.02,44.25 64.52,44.25 145.27,125 145.27,169.5 SERVO3.2
  Bottom 0.4: v3.02,33.75 5.77,33.75 GPIO1_PAR.9 | v2.52,61 2.02,61.5 2.02,70 1.52,70.5 v1.52,72.5 | v40.02,59.75 34.52,54.25 34.02,54.25 GPIO1.9
N$50
  Top 0.4: GPIO1_PAR.10 8.52,33.75 11.27,33.75 31.27,53.75 31.27,54.25 GPIO1.10
N$51  (via drill 0.35)
  Top 0.4: v38.02,40.25 v30.52,32.75 | v41.02,43.25 41.02,48.25 38.77,50.5 38.77,58 v37.27,59.5
  Bottom 0.4: v30.52,32.75 22.27,41 13.46,41 12.52,41 11.52,40 5.27,40 4.52,39.25 4.52,38 5.77,36.75 5.77,36.25 GPIO1_PAR.11 | v41.02,43.25 v38.02,40.25 | v37.27,59.5 34.52,56.75 34.02,56.75 GPIO1.11
N$52
  Top 0.4: GPIO1_PAR.12 8.52,36.25 12.27,36.25 30.02,54 30.02,55.5 31.27,56.75 GPIO1.12
N$53  (via drill 0.35)
  Top 0.4: v13.02,40 7.77,40 6.52,38.75 6.02,38.75 GPIO1_PAR.13 | v22.52,32.25 29.02,38.75 31.52,38.75 v33.02,40.25 | v38.52,46.75 38.52,47.75 36.27,50 36.27,57 34.02,59.25 GPIO1.13
  Bottom 0.4: v13.02,40 14.77,40 v22.52,32.25 | v33.02,40.25 33.02,41.25 v38.52,46.75
N$54
  Top 0.4: GPIO1_PAR.14 8.52,38.75 13.27,38.75 15.02,40.5 15.02,46 28.27,59.25 31.27,59.25 GPIO1.14
N$55  (via drill 0.35)
  Top 0.4: v3.52,46.25 3.52,44.25 5.77,42 5.77,41.5 GPIO1_PAR.15 | v3.52,49.25 3.52,52.5 4.52,53.5 v4.52,70.75 | v3.52,76 7.27,79.75 10.77,79.75 29.27,98.25 36.02,98.25 39.02,95.25 39.02,67 34.02,62 GPIO1.15
  Bottom 0.4: v3.52,49.25 v3.52,46.25 | v4.52,70.75 3.52,71.75 v3.52,76
N$56
  Top 0.4: GPIO1_PAR.16 8.52,41.5 9.02,41.5 29.27,61.75 31.27,61.75 GPIO1.16
N$57  (via drill 0.35)
  Top 0.4: v2.02,35.25 2.02,29.75 1.52,29.25 1.52,23.5 v6.02,19 | v12.27,21.75 20.27,29.75 26.02,29.75 v36.52,40.25 | v39.52,43.25 39.52,48.25 37.77,50 37.77,57.5 36.27,59 v36.27,62.75
  Bottom 0.4: v2.02,35.25 2.02,40 5.77,43.75 GPIO1_PAR.17 | v6.02,19 7.52,19 8.27,19.75 8.77,19.75 10.77,21.75 v12.27,21.75 | v39.52,43.25 v36.52,40.25 | v36.27,62.75 34.52,64.5 34.02,64.5 GPIO1.17
N$58
  Top 0.4: GPIO1_PAR.18 8.52,44 10.02,44 30.27,64.25 31.27,64.25 GPIO1.18
N$59  (via drill 0.35)
  Top 0.4: v10.27,76.25 8.27,76.25 3.52,71.5 3.52,54 2.52,53 2.52,48.75 4.77,46.5 5.77,46.5 GPIO1_PAR.19 | v12.27,78.25 29.77,95.75 35.52,95.75 36.52,94.75 v36.52,83.25 | v38.02,81.75 38.02,71 34.02,67 GPIO1.19
  Bottom 0.4: v12.27,78.25 v10.27,76.25 | v38.02,81.75 v36.52,83.25
N$60
  Top 0.4: GPIO1_PAR.20 8.52,46.5 11.02,46.5 31.27,66.75 GPIO1.20
N$61  (via drill 0.35)
  Top 0.4: v2.52,47.25 2.52,37.75 4.02,36.25 4.02,30.25 2.52,28.75 v2.52,24 | v2.52,21 2.52,5.25 6.77,1 27.52,1 42.52,16 v42.52,40.25
  Bottom 0.4: v2.52,47.25 2.52,49.75 3.02,50.25 4.02,50.25 5.27,49 5.77,49 GPIO1_PAR.21 | v2.52,21 v2.52,24 | v42.52,40.25 42.52,41.75 48.27,47.5 48.27,55.75 34.52,69.5 34.02,69.5 GPIO1.21
N$62
  Top 0.4: GPIO1_PAR.22 8.52,49 10.77,49 31.27,69.5 GPIO1.22
N$63  (via drill 0.35)
  Top 0.4: v1.52,55 1.52,71 7.77,77.25 14.27,77.25 30.77,93.75 34.52,93.75 35.27,93 35.27,73.5 34.02,72.25 GPIO1.23
  Bottom 0.4: v1.52,55 5.02,51.5 5.77,51.5 GPIO1_PAR.23
N$64
  Top 0.4: GPIO1_PAR.24 8.52,51.5 10.77,51.5 31.27,72 GPIO1.24
N$65
  Bottom 0.4: GPIO1_PAR.25 7.06,55.25 7.06,57.03 7.8,57.77 9.59,57.77 12.78,60.96 19.81,60.96 30.06,71.21 30.06,72.59 30.8,73.33 31.84,73.33 33.12,74.61 GPIO1.25
N$66
  Top 0.4: GPIO1_PAR.26 8.52,54 10.77,54 31.27,74.5 GPIO1.26
N$67
  Bottom 0.4: GPIO1_PAR.27 6.16,56.89 6.16,57.41 7.06,58.31 7.06,59.57 7.8,60.31 9.59,60.31 11.51,62.23 19.3,62.23 29.16,72.08 29.16,74.23 30.8,75.87 32.95,75.87 33.86,76.79 GPIO1.27
N$68
  Top 0.4: GPIO1_PAR.28 8.52,56.75 11.02,56.75 31.27,77 GPIO1.28
N$69  (via drill 0.35)
  Top 0.4: v2.52,73.5 7.77,78.75 11.27,78.75 29.77,97.25 35.52,97.25 37.77,95 37.77,83 v36.27,81.5
  Bottom 0.4: v2.52,73.5 2.52,71 3.02,70.5 3.02,62 5.77,59.25 GPIO1_PAR.29 | v36.27,81.5 34.52,79.75 34.02,79.75 GPIO1.29
N$70
  Top 0.4: GPIO1_PAR.30 8.52,59.25 11.02,59.25 31.27,79.5 GPIO1.30
N$71
  Bottom 0.4: GPIO1_PAR.31 7.06,62.87 8.85,62.87 9.48,63.5 16,63.5 30.06,77.56 30.06,77.67 30.81,78.43 31.84,78.43 32.6,79.18 32.6,80.21 33.34,80.95 33.45,80.95 33.86,81.36 GPIO1.31
N$72
  Top 0.4: GPIO1_PAR.32 8.52,61.75 11.02,61.75 31.27,82 GPIO1.32
N$73
  Bottom 0.4: GPIO1_PAR.33 7.06,65.41 8.85,65.41 9.99,66.55 17.02,66.55 30.06,79.59 30.06,80.21 30.81,80.97 31.84,80.97 32.58,81.71 32.58,81.79 32.58,83.49 GPIO1.33
N$74
  Top 0.4: GPIO1_PAR.34 8.52,64.25 10.77,64.25 31.27,84.75 GPIO1.34
N$75
  Bottom 0.4: GPIO1.35 32.58,86.03 30.8,86.03 12.7,67.93 7.8,67.93 6.54,66.67 GPIO1_PAR.35
N$76
  Top 0.4: GPIO1_PAR.36 8.52,66.75 10.77,66.75 31.27,87.25 GPIO1.36
N$77
  Bottom 0.4: GPIO1_PAR.37 7.06,70.49 8.85,70.49 9.73,71.37 13.97,71.37 30.06,87.46 30.06,87.83 30.81,88.59 31.84,88.59 33.11,89.85 GPIO1.37
N$78
  Top 0.4: GPIO1_PAR.38 8.52,69.25 10.77,69.25 31.27,89.75 GPIO1.38
N$79  (via drill 0.35)
  Top 0.4: v13.77,78.25 30.27,94.75 35.02,94.75 v35.52,94.25
  Bottom 0.4: v13.77,78.25 10.77,75.25 9.52,75.25 6.02,71.75 GPIO1_PAR.39 | v35.52,94.25 33.77,92.5 GPIO1.39
N$80
  Top 0.4: GPIO1_PAR.40 10.77,71.75 31.27,92.25 GPIO1.40
N$81
  Top 0.4: RASPI.1 218.02,22.25 276.52,22.25 288.52,34.25 RASPI_PAR.1
N$82  (via drill 0.35)
  Top 0.4: v220.27,23.25 276.02,23.25 285.77,33 285.77,34.25 RASPI_PAR.2
  Bottom 0.4: v220.27,23.25 220.27,21.25 219.02,20 217.52,20 215.52,22 RASPI.2
N$83  (via drill 0.35)
  Top 0.4: v223.77,21.25 277.02,21.25 288.77,33 289.02,33 289.77,33.75 289.77,35.5 288.52,36.75 RASPI_PAR.3
  Bottom 0.4: v223.77,21.25 220.27,24.75 RASPI.3
N$84  (via drill 0.35)
  Top 0.4: v271.52,20.25 215.52,20.25 214.02,21.75 214.02,22.75 215.27,24 215.27,24.75 RASPI.4 | v275.52,24.25 284.52,33.25 284.52,35.5 285.77,36.75 RASPI_PAR.4
  Bottom 0.4: v275.52,24.25 v271.52,20.25
N$85  (via drill 0.35)
  Top 0.4: v282.52,32.75 274.02,24.25 231.02,24.25 228.02,27.25 218.02,27.25 RASPI.5 | v286.27,29 289.27,32 289.52,32 290.77,33.25 290.77,37 288.52,39.25 RASPI_PAR.5
  Bottom 0.4: v286.27,29 v282.52,32.75
N$86  (via drill 0.35)
  Top 0.4: v265.77,19.25 215.02,19.25 213.02,21.25 213.02,24.25 215.27,26.5 215.27,27.25 RASPI.6 | v272.77,26.25 285.77,39.25 RASPI_PAR.6
  Bottom 0.4: v272.77,26.25 v265.77,19.25
N$87  (via drill 0.35)
  Top 0.4: v283.27,33.75 282.02,33.75 273.52,25.25 231.52,25.25 227.02,29.75 218.02,29.75 RASPI.7
  Bottom 0.4: v283.27,33.75 285.02,32 288.02,32 289.77,33.75 289.77,37.5 290.77,38.5 290.77,40.25 289.02,42 288.52,42 RASPI_PAR.7
N$88  (via drill 0.35)
  Top 0.4: v224.02,18.25 214.52,18.25 211.52,21.25 211.52,25.25 215.27,29 215.27,29.75 RASPI.8 | v232.02,26.25 270.27,26.25 285.77,41.75 RASPI_PAR.8 | v53.02,45.25 v45.02,53.25 | v61.02,37.25 116.02,37.25 121.27,32 v211.77,32
  Bottom 0.4: v232.02,26.25 v224.02,18.25 | v45.02,53.25 43.52,53.25 37.02,46.75 34.02,46.75 GPIO1.3 32.58,47.95 32.58,49.73 31.84,50.47 30.72,50.47 25.12,44.87 25.12,41.38 28.96,37.54 28.96,35.58 31.42,33.12 31.42,32.38 30.89,31.85 30.14,31.85 28.72,33.27 25.65,33.27 23.73,31.35 22.14,31.35 22,31.5 21.54,31.5 21.39,31.65 17.89,31.65 13.54,27.29 7.8,27.29 6.54,26.03 GPIO1_PAR.3 | v61.02,37.25 v53.02,45.25 | v211.77,32 212.77,32 214.77,30 215.27,30 RASPI.8
N$89  (via drill 0.35)
  Top 0.4: v220.52,36.5 220.52,37.25 250.27,67 v261.27,67 | v289.77,55.5 v289.77,79 | v290.77,53 290.77,46.75 288.52,44.5 RASPI_PAR.9
  Bottom 0.4: v220.52,36.5 220.52,35 218.02,32.5 RASPI.9 | v261.27,67 281.02,86.75 286.77,86.75 290.77,82.75 290.77,80 v289.77,79 | v289.77,55.5 290.77,54.5 v290.77,53
N$90  (via drill 0.35)
  Top 0.4: v225.52,18.25 223.52,16.25 215.02,16.25 210.52,20.75 210.52,26.75 215.27,31.5 215.27,32.25 RASPI.10 | v234.52,27.25 268.77,27.25 285.77,44.25 RASPI_PAR.10
  Bottom 0.4: v234.52,27.25 v225.52,18.25
N$91  (via drill 0.35)
  Top 0.4: v284.27,48.75 233.77,48.75 223.02,38 223.02,37.25 220.77,35 218.02,35 RASPI.11
  Bottom 0.4: v284.27,48.75 284.77,48.75 285.27,48.25 286.52,48.25 287.77,47 288.27,47 RASPI_PAR.11
N$92  (via drill 0.35)
  Top 0.4: v257.27,18.25 254.27,15.25 214.52,15.25 209.52,20.25 209.52,28.25 215.27,34 215.27,34.75 RASPI.12 | v267.27,28.25 285.77,46.75 RASPI_PAR.12
  Bottom 0.4: v267.27,28.25 v257.27,18.25
N$93  (via drill 0.35)
  Top 0.4: v224.02,37.5 274.52,37.5 285.27,48.25 287.02,48.25 288.27,49.5 RASPI_PAR.13
  Bottom 0.4: v224.02,37.5 218.02,37.5 RASPI.13
N$94  (via drill 0.35)
  Top 0.4: v243.27,69 226.02,69 223.27,71.75 214.77,71.75 214.02,71 214.02,39.5 215.27,38.25 215.27,37.5 RASPI.14 | v248.52,63.75 271.77,63.75 285.77,49.75 RASPI_PAR.14
  Bottom 0.4: v248.52,63.75 v243.27,69
N$95  (via drill 0.35)
  Top 0.4: v247.77,66 221.77,40 RASPI.15 | v268.02,87.75 288.77,87.75 290.77,85.75 290.77,54.5 288.52,52.25 RASPI_PAR.15
  Bottom 0.4: v247.77,66 247.77,67.5 v268.02,87.75
N$96  (via drill 0.35)
  Top 0.4: v213.02,40 213.02,71.5 214.27,72.75 223.77,72.75 226.27,70.25 265.52,70.25 266.77,71.5 v267.77,71.5 | v270.01,69 270.01,68.01 285.77,52.25 RASPI_PAR.16
  Bottom 0.4: v213.02,40 215.27,40 RASPI.16 | v270.01,69 267.77,71.25 v267.77,71.5
N$97
  Bottom 0.4: RASPI.17 276.43,42.53 284.69,50.8 284.69,52.58 285.43,53.32 287.21,53.32 RASPI_PAR.17
N$98  (via drill 0.35)
  Top 0.4: v211.52,45.75 211.52,71.5 214.27,74.25 223.77,74.25 226.77,71.25 265.02,71.25 266.27,72.5 v268.27,72.5 | v271.02,69.75 286.02,54.75 RASPI_PAR.18
  Bottom 0.4: v211.52,45.75 214.52,42.75 215.27,42.75 RASPI.18 | v271.02,69.75 v268.27,72.5
N$99
  Bottom 0.4: RASPI.19 276.43,45.08 283.79,52.44 283.79,54.22 285.43,55.86 287.21,55.86 RASPI_PAR.19
N$100  (via drill 0.35)
  Top 0.4: v210.52,49.25 210.52,72 213.77,75.25 224.27,75.25 227.27,72.25 261.52,72.25 263.52,74.25 268.52,74.25 v269.52,73.25 | v272.52,70.25 285.77,57 RASPI_PAR.20
  Bottom 0.4: v210.52,49.25 214.52,45.25 215.27,45.25 RASPI.20 | v272.52,70.25 v269.52,73.25
N$101
  Bottom 0.4: RASPI.21 276.43,47.62 282.89,54.08 282.89,55.86 285.43,58.4 287.21,58.4 RASPI_PAR.21
N$102  (via drill 0.35)
  Top 0.4: v209.52,53 209.52,72.5 213.27,76.25 268.02,76.25 v270.52,73.75 | v272.77,71.5 284.52,59.75 285.77,59.75 RASPI_PAR.22
  Bottom 0.4: v209.52,53 214.77,47.75 215.27,47.75 RASPI.22 | v272.77,71.5 v270.52,73.75
N$103
  Bottom 0.4: RASPI.23 276.43,50.16 281.99,55.72 281.99,57.5 285.43,60.94 287.21,60.94 RASPI_PAR.23
N$104  (via drill 0.35)
  Top 0.4: v208.52,56.5 208.52,73 212.77,77.25 268.52,77.25 v271.02,74.75 | v274.02,71.75 275.27,71.75 284.77,62.25 285.77,62.25 RASPI_PAR.24
  Bottom 0.4: v208.52,56.5 214.77,50.25 215.27,50.25 RASPI.24 | v274.02,71.75 v271.02,74.75
N$105
  Bottom 0.4: RASPI.25 276.43,52.7 281.09,57.36 281.09,59.14 285.43,63.48 287.21,63.48 RASPI_PAR.25
N$106  (via drill 0.35)
  Top 0.4: v207.52,60 207.52,73.5 212.27,78.25 269.02,78.25 v272.02,75.25 | v274.27,73 275.52,73 283.52,65 285.77,65 RASPI_PAR.26
  Bottom 0.4: v207.52,60 214.77,52.75 215.27,52.75 RASPI.26 | v274.27,73 v272.02,75.25
N$107
  Bottom 0.4: RASPI.27 276.43,55.23 280.19,59 280.19,60.78 285.43,66.02 287.21,66.02 RASPI_PAR.27
N$108  (via drill 0.35)
  Top 0.4: v248.77,67 247.27,67 236.77,56.5 217.27,56.5 216.02,55.25 215.52,55.25 RASPI.28
  Bottom 0.4: v248.77,67 249.77,66 284.02,66 285.27,67.25 285.77,67.25 RASPI_PAR.28
N$109  (via drill 0.35)
  Top 0.4: v265.02,65 267.02,67 v268.02,67
  Bottom 0.4: RASPI.29 257.79,57.77 v265.02,65 | v268.02,67 283.74,67 285.31,68.56 287.21,68.56 RASPI_PAR.29
N$110  (via drill 0.35)
  Top 0.4: v206.52,66 206.52,74 211.77,79.25 v276.02,79.25
  Bottom 0.4: v206.52,66 214.52,58 215.27,58 RASPI.30 | v276.02,79.25 285.27,70 285.77,70 RASPI_PAR.30
N$111  (via drill 0.35)  (1 unrouted)
  Top 0.4: v280.02,71 285.33,71 285.43,71.1 286.47,71.1 286.58,71 287.11,71 RASPI_PAR.31 | v274.04,77.11 272.57,77.11 271.33,78.35 270.81,78.35
  Bottom 0.4: v280.02,71 278.72,72.3 276.31,72.3 274.04,74.57 v274.04,77.11 | v270.84,78.36 270,79.2 270,89.05 267.77,91.29 259.49,91.29 228.51,60.31 RASPI.31
N$112  (via drill 0.35)
  Top 0.4: v205.52,69.5 205.52,74.5 211.27,80.25 v277.02,80.25
  Bottom 0.4: v205.52,69.5 214.52,60.5 215.27,60.5 RASPI.32 | v277.02,80.25 277.52,80.25 285.27,72.5 285.77,72.5 RASPI_PAR.32
N$113  (via drill 0.35)
  Top 0.4: v281.05,72.39 282.32,73.66 285.43,73.66 286.47,73.66 286.48,73.66 287.4,73.66 287.4,73.83 RASPI_PAR.33 | v264.16,67.06 262.13,65.02 v251.21,65.02 | v233.68,62.23 222,62.23 221.37,62.85 RASPI.33
  Bottom 0.4: RASPI_PAR.33 288.49,74.75 | v281.05,72.39 280.92,72.25 280.92,70.63 278.23,67.94 265.05,67.94 v264.16,67.06 | v251.21,65.02 248.41,62.23 v233.68,62.23
N$114  (via drill 0.35)
  Top 0.4: v204.52,73.25 204.52,75 210.77,81.25 v278.02,81.25
  Bottom 0.4: v204.52,73.25 214.77,63 215.27,63 RASPI.34 | v278.02,81.25 279.02,81.25 285.27,75 285.77,75 RASPI_PAR.34
N$115  (via drill 0.35)
  Top 0.4: RASPI.35 238.37,65.39 v239.52,66.55 | RASPI_PAR.35 287.21,76.18 276.18,76.18 272.89,72.9 272.8,72.9 270,70.1 269.75,70.1 v268.48,68.83 | v261.62,69.34 261.87,69.09 v264.92,69.09
  Bottom 0.4: v239.52,66.55 262.13,89.15 265.68,89.15 266.19,88.65 268.39,88.65 268.92,88.12 268.92,76.64 v261.62,69.34 | v268.48,68.83 265.18,68.83 v264.92,69.09
N$116  (via drill 0.35)
  Top 0.4: v222.52,82.25 274.52,82.25 275.52,83.25 v279.52,83.25
  Bottom 0.4: v222.52,82.25 212.27,72 212.27,68.5 215.27,65.5 RASPI.36 | v279.52,83.25 285.27,77.5 285.77,77.5 RASPI_PAR.36
N$118  (via drill 0.35)
  Top 0.4: v225.02,83.25 272.52,83.25 273.77,84.5 v280.77,84.5
  Bottom 0.4: v225.02,83.25 213.27,71.5 213.27,70 215.27,68 RASPI.38 | v280.77,84.5 285.27,80 RASPI_PAR.38
N$120  (via drill 0.35)
  Top 0.4: v228.77,84.25 272.02,84.25 273.52,85.75 v282.52,85.75
  Bottom 0.4: v228.77,84.25 215.52,71 215.52,70.5 RASPI.40 | v282.52,85.75 285.77,82.5 RASPI_PAR.40
N$121
  Top 0.4: ADC_PAR.10 6.02,14 19.27,27.25 31.27,27.25 ADC.10
N$122  (via drill 0.35)
  Top 0.4: v19.77,26.25 8.52,15 8.52,14 ADC_PAR.9 | v21.77,28.25 30.27,28.25 30.77,28.75 32.52,28.75 32.64,28.62 | 32.64,28.62 33.77,27.5 ADC.9 | v82.52,180.25 82.52,125.5 v75.52,118.5 | v45.52,84 45.52,74.75 42.77,72 42.77,51 v46.52,47.25 | v39.52,40.25 39.52,35.5 32.64,28.62
  Bottom 0.4: v21.77,28.25 v19.77,26.25 | v82.52,180.25 84.02,181.75 POT1.2 | v75.52,118.5 49.02,92 49.02,87.5 v45.52,84 | v39.52,40.25 v46.52,47.25
N$123  (via drill 0.35)
  Top 0.4: v11.27,16.25 19.77,24.75 31.27,24.75 ADC.8 | v96.27,178 96.27,132.75 v78.52,115
  Bottom 0.4: v11.27,16.25 5.02,16.25 3.52,14.75 3.52,13.25 5.27,11.5 5.77,11.5 ADC_PAR.8 | v96.27,178 98.52,180.25 98.52,183.5 POT2.2 | v78.52,115 78.52,94.5 49.27,65.25 49.27,35 47.02,32.75 33.52,32.75 29.02,28.25 29.02,26.5 30.77,24.75 31.27,24.75 ADC.8
N$124  (via drill 0.35)
  Top 0.4: ADC_PAR.7 8.52,11.5 30.02,11.5 35.27,16.75 35.27,23.5 34.02,24.75 ADC.7 | v113.27,179 113.27,155 v141.27,127 | v153.27,115 153.27,91 139.02,76.75 139.02,45.5 140.02,44.5 140.02,39.75 133.27,33 121.77,33 116.52,38.25 49.52,38.25 45.52,34.25 45.52,30.75 v44.52,29.75
  Bottom 0.4: v113.27,179 113.27,183.5 POT3.2 | v153.27,115 v141.27,127 | v44.52,29.75 39.77,25 34.02,25 ADC.7
N$125  (via drill 0.35)
  Top 0.4: v8.27,18.25 4.52,14.5 4.52,11 5.77,9.75 5.77,9 ADC_PAR.6 | v12.77,16.25 18.52,22 31.27,22 ADC.6 | v101.27,176.75 110.27,185.75 125.02,185.75 127.02,183.75 POT4.2 | v99.77,175.25 99.77,134.75 v79.52,114.5 | v59.77,74.25 59.77,66.5 v46.77,53.5 | v37.02,37.75 31.02,31.75 30.77,31.75 v28.27,29.25
  Bottom 0.4: v8.27,18.25 10.77,18.25 v12.77,16.25 | v99.77,175.25 v101.27,176.75 | v79.52,114.5 79.52,94 v59.77,74.25 | v46.77,53.5 34.02,40.75 34.02,39.75 36.02,37.75 v37.02,37.75 | v28.27,29.25 28.02,29 28.02,24.75 30.77,22 31.27,22 ADC.6
N$126  (via drill 0.35)
  Top 0.4: 34.14,14.12 36.27,16.25 v36.27,20.5 | 34.14,14.12 29.02,9 8.52,9 ADC_PAR.5 | v76.02,117.5 92.27,133.75 92.27,173.25 POT5.2 | v43.77,71.5 43.77,53 v51.52,45.25 | v34.52,14 34.27,14 34.14,14.12
  Bottom 0.4: v36.27,20.5 34.52,22.25 34.02,22.25 ADC.5 | v76.02,117.5 59.52,101 59.52,87.25 v43.77,71.5 | v51.52,45.25 51.52,27.25 38.27,14 v34.52,14
N$127  (via drill 0.35)
  Top 0.4: v11.02,20.5 9.02,20.5 3.52,15 3.52,9.25 5.77,7 5.77,6.5 ADC_PAR.4 | v14.77,16.75 28.52,16.75 29.14,17.38 | 29.14,17.38 31.27,19.5 ADC.4 | v81.02,114.5 105.52,139 105.52,173.25 POT6.2 | v32.27,15.25 31.27,15.25 29.14,17.38
  Bottom 0.4: v14.77,16.75 v11.02,20.5 | v81.02,114.5 81.02,94 50.52,63.5 50.52,27.75 37.77,15 32.52,15 v32.27,15.25
N$128  (via drill 0.35)
  Top 0.4: v37.82,18.58 37.87,18.53 37.87,15.85 25.27,3.25 22.77,3.25 19.77,6.25 8.52,6.25 ADC_PAR.3 | v140.27,124.5 143.27,127.5 143.27,132 119.77,155.5 119.77,173.25 POT7.2 | v151.52,113.25 151.52,90.75 138.02,77.25 138.02,45 139.02,44 139.02,40.25 132.77,34 122.27,34 117.02,39.25 49.02,39.25 44.52,34.75 44.52,31.25 43.77,30.5 v43.77,23.95
  Bottom 0.4: ADC.3 34.02,19.75 35.33,19.75 36.5,18.58 v37.82,18.58 38.41,18.58 v43.77,23.95 | v151.52,113.25 v140.27,124.5
N$129  (via drill 0.35)
  Top 0.4: v34.77,11.25 25.77,2.25 8.02,2.25 6.52,3.75 6.02,3.75 ADC_PAR.2
  Bottom 0.4: v34.77,11.25 31.27,14.75 31.27,17 ADC.2
N$131  (via drill 0.35)
  Top 0.4: v28.27,164.25 28.27,166.75 ENCODER_1.3 29.02,167.25 37.52,158.75 37.52,147.25 60.77,124 60.77,120.75 75.02,106.5 116.77,106.5 v117.77,105.5 | v123.02,96.75 127.52,92.25 GPIO0.1
  Bottom 0.4: v28.27,164.25 27.02,164.25 6.77,144 6.77,143.25 GPIO0_PAR.1 | v123.02,96.75 123.02,100.25 v117.77,105.5
N$132  (via drill 0.35)
  Top 0.4: v16.52,150.5 16.52,160.25 24.52,168.25 ENCODER_1.5 | v126.27,98 130.02,94.25 130.02,92.25 GPIO0.2 | v123.77,105 121.27,107.5 75.52,107.5 61.77,121.25 61.77,124.5 38.52,147.75 38.52,159.25 v31.77,166
  Bottom 0.4: v16.52,150.5 9.27,143.25 GPIO0_PAR.2 | v126.27,98 128.02,99.75 128.02,100.75 v123.77,105 | v31.77,166 31.02,165.25 26.27,165.25 24.52,167 24.52,168.25 ENCODER_1.5
N$133  (via drill 0.35)
  Top 0.4: v4.27,140.75 4.27,144.25 7.52,147.5 19.52,147.5 30.02,158 ENCODER_2.3 | v121.77,95.5 127.52,89.75 GPIO0.3 | v116.27,105.5 74.52,105.5 59.77,120.25 59.77,123.5 36.52,146.75 36.52,150.5 v34.77,152.25
  Bottom 0.4: v4.27,140.75 6.52,140.75 GPIO0_PAR.3 | v121.77,95.5 121.77,100 v116.27,105.5 | v34.77,152.25 30.02,157 30.02,158 ENCODER_2.3
N$135  (via drill 0.35)
  Top 0.4: GPIO0_PAR.5 6.52,138.25 6.52,138.75 5.27,140 5.27,143.75 8.02,146.5 28.02,146.5 30.02,148.5 ENCODER_3.3 | v120.52,94.25 127.52,87.25 GPIO0.5 | v116.77,98 112.27,102.5 73.02,102.5 60.27,115.25 55.02,115.25 52.77,117.5 52.77,124.25 v35.27,141.75
  Bottom 0.4: v116.77,98 v120.52,94.25 | v35.27,141.75 29.77,147.25 29.77,148.25 30.02,148.5 ENCODER_3.3
N$136  (via drill 0.35)
  Top 0.4: v33.27,145.5 26.02,138.25 9.27,138.25 GPIO0_PAR.6 | v127.02,100.25 132.52,94.75 132.52,90 130.27,87.75 130.27,87.25 GPIO0.6 | v122.77,104.5 74.02,104.5 58.77,119.75 58.77,123 35.27,146.5 35.27,148.5 ENCODER_3.5
  Bottom 0.4: v33.27,145.5 35.02,147.25 35.02,148.5 ENCODER_3.5 | v122.77,104.5 v127.02,100.25
N$137  (via drill 0.35)
  Top 0.4: v134.27,102 137.27,102 v145.02,109.75 | v147.02,111.75 185.27,150 249.02,150 251.02,148 ENCODER_4.3
  Bottom 0.4: v134.27,102 125.27,93 125.27,87 127.52,84.75 GPIO0.7 | v145.02,109.75 v147.02,111.75 147.62,112.35 151.89,112.35 154.17,114.63 154.17,117.12 142.39,128.9 77.14,128.9 59.99,111.75 47.53,111.75 25,134.29 7.82,134.29 GPIO0_PAR.7
N$140  (via drill 0.35)
  Top 0.4: v31.52,133.25 9.27,133.25 GPIO0_PAR.10 | v56.02,136 78.52,113.5 125.77,113.5 v128.77,110.5 | v251.02,160.5 188.52,160.5 147.02,119 v147.02,116
  Bottom 0.4: v31.52,133.25 32.52,133.25 36.02,129.75 49.77,129.75 v56.02,136 | 128.79,110.47 135.52,103.75 135.52,86.75 130.77,82 130.27,82 GPIO0.10 | 128.79,110.47 v128.77,110.5 | v251.02,160.5 254.52,160.5 256.02,159 256.02,157.5 ENCODER_5.5 | v147.02,116 142.95,120.06 138.38,120.06 128.79,110.47
N$141  (via drill 0.35)
  Top 0.4: v142.02,78.25 143.77,78.25 214.52,149 v233.52,149 | v74.17,121.67 60.96,134.87 v58.93,134.87 | GPIO0_PAR.13 7.3,127.94 8.56,129.21 28.88,129.21 v30.48,130.81
  Bottom 0.4: v142.02,78.25 129.52,78.25 128.27,77 127.77,77 GPIO0.13 116.06,88.6 115.39,88.6 111.12,92.88 111.12,93.87 113.87,96.62 113.87,105.87 117.6,109.61 117.6,117.35 82.44,117.35 77.39,122.4 76.14,122.4 75.41,121.67 v74.17,121.67 | v233.52,149 247.77,163.25 249.27,163.25 251.02,165 251.02,166.25 EMCODER_6.3 | v58.93,134.87 56.16,134.87 50.14,128.85 35.64,128.85 33.68,130.81 v30.48,130.81
N$167
  Top 0.4: LED1.C 72.02,172.75 68.52,172.75 R1.2
N$172
  Top 0.4: LED3.C 220.77,171.5 216.27,171.5 R3.2
N$193  (via drill 0.35)
  Top 0.4: v160.77,153.5 160.77,155.75 159.52,157 159.52,181.25 165.04,186.78 234.99,186.78 240.52,181.25 LUCESITAS.2
  Bottom 0.4: v160.77,153.5 160.77,150.5 CONTROL_RGB.2
N$194  (via drill 0.35)
  Top 0.4: v181.27,159.25 184.27,159.25 195.02,170 232.02,170 243.02,181 LUCESITAS.3
  Bottom 0.4: v181.27,159.25 173.77,151.75 173.77,150.5 CONTROL_RGB.7
N$195
  Top 0.4: CONTROL_RGB.9 176.27,158.25 184.77,158.25 195.52,169 233.52,169 245.52,181 LUCESITAS.4
(copper drawn outside any net)
  shapes: Top area x2

## Text on the board
Top: + | + | 5Volts | 12Volts | + | 3.3Volts | Robocol Uniandes 2019 | + | Miguel Angel Díaz Rivera 201511693